# EAGLE design RomWriter (EAGLE 7.2.0)
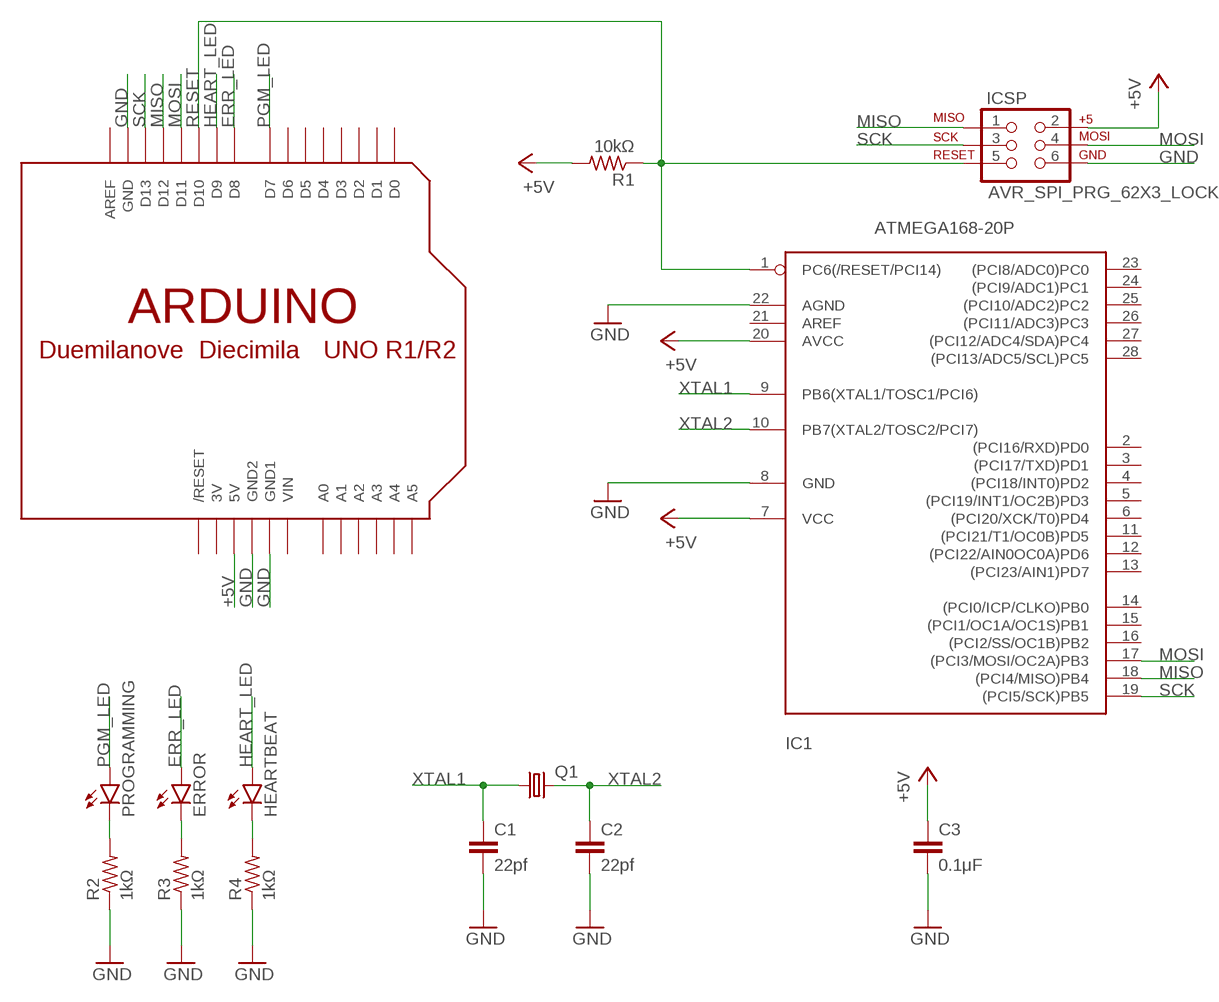
[diagram p0: schematic, sheet 1]

## Parts
C1  22pf  C2.5/2  [C2.5-2]
C2  22pf  C2.5/2  [C2.5-2]
C3  0.1μF  C2.5/2  [C2.5-2]
ERROR  LED3MM  [LED3MM]
HEARTBEAT  LED3MM  [LED3MM]
IC1  ATMEGA168-20P  [DIL28-3]
ICSP  AVR_SPI_PRG_62X3_LOCK  [2X3_LOCK]
PROGRAMMING  LED3MM  [LED3MM]
Q1  CRYSTALHC49S  [HC49/S]
R1  10kΩ  FLIPFLOP-RES  [0805-THM]
R2  1kΩ  FLIPFLOP-RES  [0805-THM]
R3  1kΩ  FLIPFLOP-RES  [0805-THM]
R4  1kΩ  FLIPFLOP-RES  [0805-THM]
U$1  ARDUINO_SHIELD_VER2  [ARDUINO_SHIELD]

## Nets
+5V: C3.1 IC1.7(VCC) IC1.20(AVCC) ICSP.2 R1.2 U$1.5V
ERR_LED: ERROR.A U$1.D8
GND: C1.2 C2.2 C3.2 IC1.8(GND) IC1.22(AGND) ICSP.6 R2.1 R3.1 R4.1 U$1.GND U$1.GND1 U$1.GND2
HEART_LED: HEARTBEAT.A U$1.D9
MISO: IC1.18((PCI4/MISO)PB4) ICSP.1 U$1.D12
MOSI: IC1.17((PCI3/MOSI/OC2A)PB3) ICSP.4 U$1.D11
N$6: PROGRAMMING.K(C) R2.2
N$7: ERROR.K(C) R3.2
N$8: HEARTBEAT.K(C) R4.2
PGM_LED: PROGRAMMING.A U$1.D7
RESET: IC1.1(PC6(/RESET/PCI14)) ICSP.5 R1.1 U$1.D10
SCK: IC1.19((PCI5/SCK)PB5) ICSP.3 U$1.D13
XTAL1: C1.1 IC1.9(PB6(XTAL1/TOSC1/PCI6)) Q1.1
XTAL2: C2.1 IC1.10(PB7(XTAL2/TOSC2/PCI7)) Q1.2
Unconnected: IC1.2((PCI16/RXD)PD0) IC1.3((PCI17/TXD)PD1) IC1.4((PCI18/INT0)PD2) IC1.5((PCI19/INT1/OC2B)PD3) IC1.6((PCI20/XCK/T0)PD4) IC1.11((PCI21/T1/OC0B)PD5) IC1.12((PCI22/AIN0OC0A)PD6) IC1.13((PCI23/AIN1)PD7) IC1.14((PCI0/ICP/CLKO)PB0) IC1.15((PCI1/OC1A/OC1S)PB1) IC1.16((PCI2/SS/OC1B)PB2) IC1.21(AREF) IC1.23((PCI8/ADC0)PC0) IC1.24((PCI9/ADC1)PC1) IC1.25((PCI10/ADC2)PC2) IC1.26((PCI11/ADC3)PC3) IC1.27((PCI12/ADC4/SDA)PC4) IC1.28((PCI13/ADC5/SCL)PC5) U$1.A0 U$1.A1 U$1.A2 U$1.A3 U$1.A4 U$1.A5 U$1.AREF U$1.D0 U$1.D1 U$1.D2 U$1.D3 U$1.D4 U$1.D5 U$1.D6 U$1.RESET(/RESET)

## Power pins joined to a net without a drawn wire
3V: U$1.3V
VIN: U$1.VIN

## Library data of the parts
C1-C3 = capacitor-wima:C: CAPACITOR naming: grid - package width
ERROR HEARTBEAT PROGRAMMING = SparkFun-LED:LED: LEDs Standard schematic elements and footprints for 5mm, 3mm, 1206, and 0603 sized LEDs. 5mm - Spark Fun Electronics SKU : COM-00529 (and others)
IC1 = mylib:ATMEGA168*P: MICROCONTROLLER 16 kBytes FLASH 1 kBytes SRAM 512 Bytes EEPROM USART 8-channel 10 bit ADC
ICSP = mylib:AVR_SPI_PRG_6: AVR ISP 6 Pin This is the reduced ISP connector for AVR programming. Common on Arduino. This footprint will take up less PCB space and can be used with a 10-pin to 6-pin adapter such as SKU: BOB-08508 **Special note about "TEST_POINT" package. The stop mask is on the top side, so if you want your programming test points to be on the bottom of your board, make sure to place this package on the bottom side of the board. This also ensure that the orientation to program from the bottom side will be correct.
Q1 = adafruit:CRYSTAL: CRYSTAL; OC_FARNELL: 1667008; OC_NEWARK: unknown
R1-R4 = adafruit:FLIPFLOP-RES: Flip Flop resistor An 0805 resistor inside a standard 1/4W 5% resistor. Makes for easy mods
U$1 = mylib:ARDUINO_SHIELD_VER2

## Board
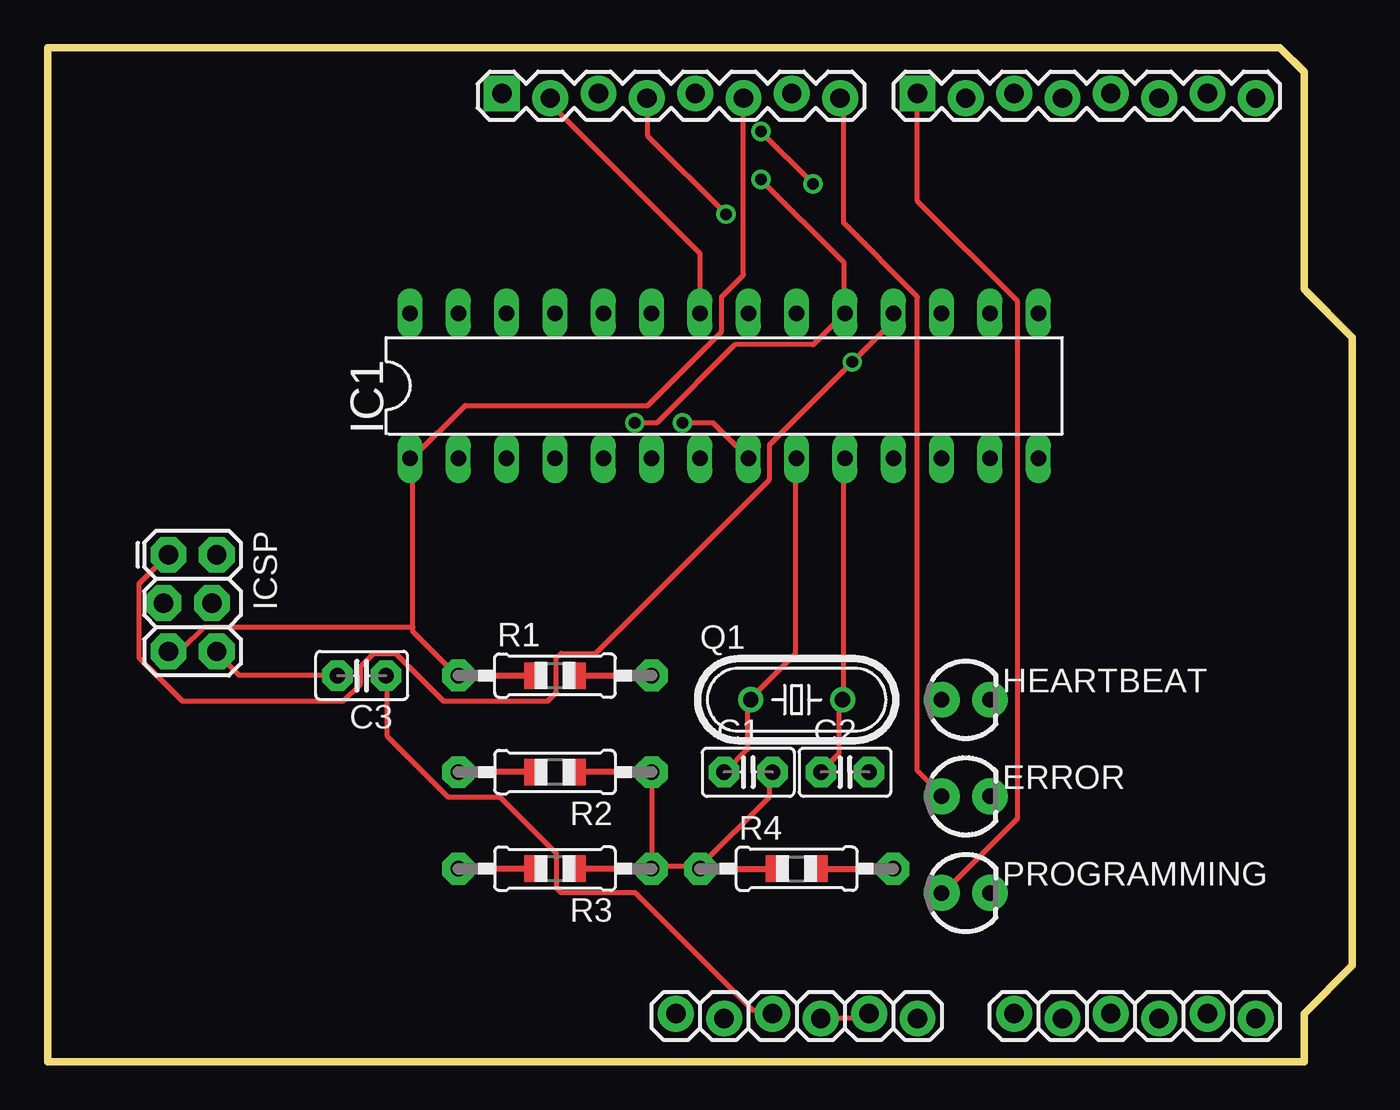
[diagram p1: board, top side]
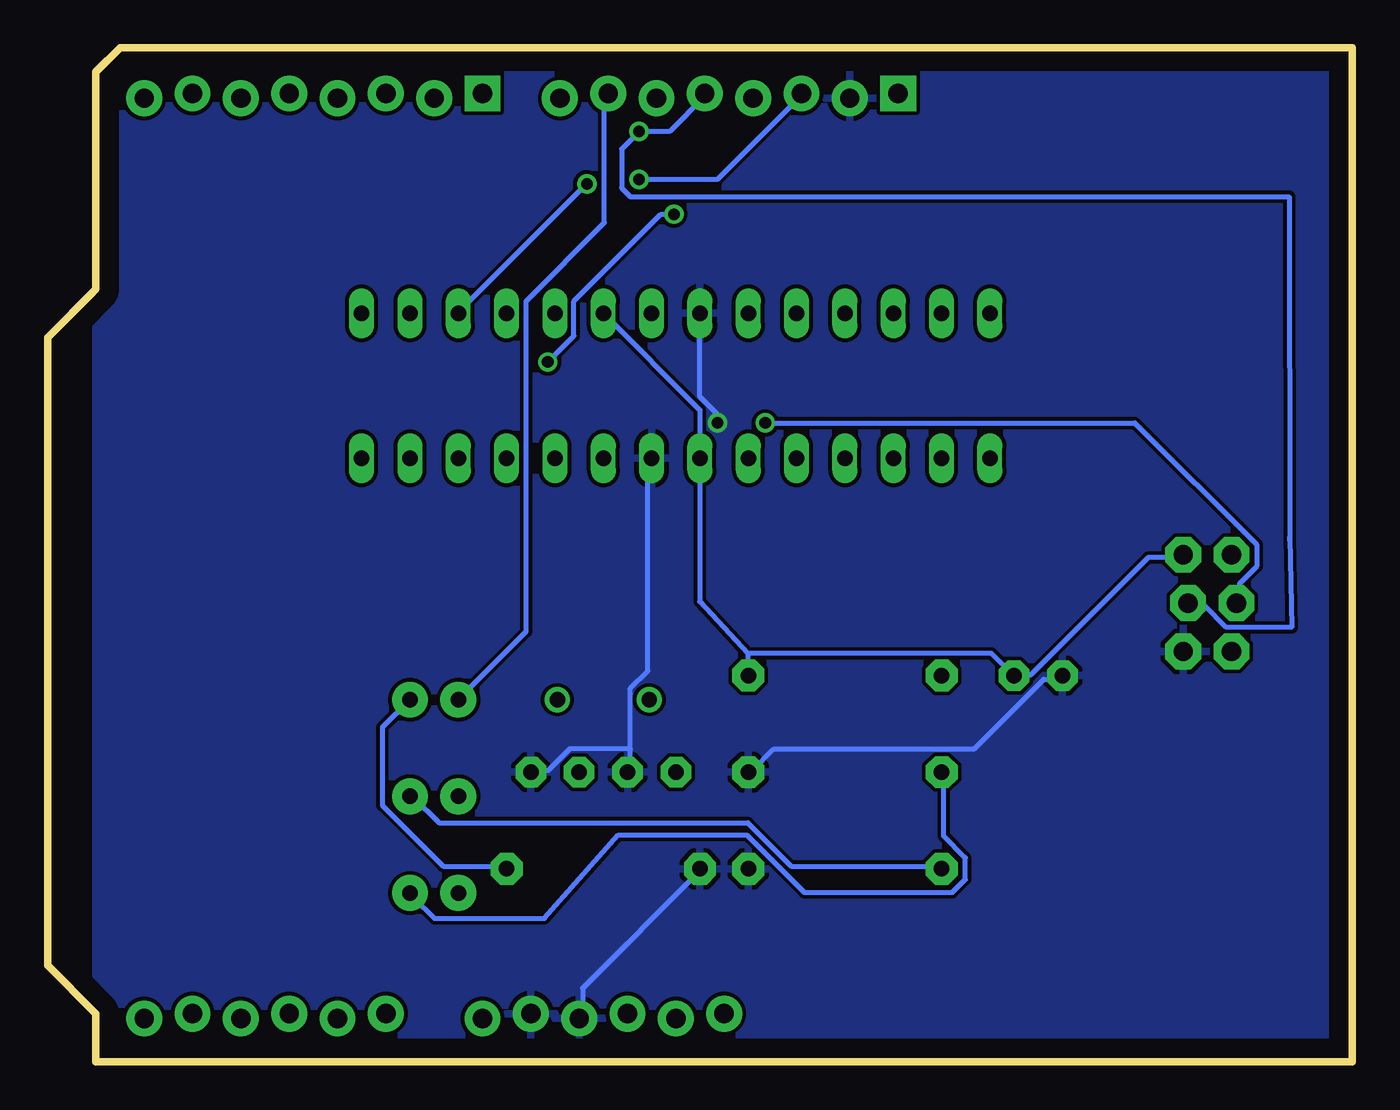
[diagram p2: board, bottom side, seen from below]

Size 68.58 x 53.34 mm. Coordinates in mm from the lower left corner, seen from the top.
Outline: 0,0 66.04,0 66.04,2.54 68.58,5.08 68.58,38.1 66.04,40.64 66.04,52.07 64.77,53.34 0,53.34 0,0
Copper layers (1*16): Top 0.035mm / dielectric 1.5mm / Bottom 0.035mm
Design rules "default": minimum track width 10mil, minimum drill 24mil, track to track 8mil, track to pad 8mil, pad to pad 8mil, via to via 8mil, smd to smd 8mil, copper to edge 40mil, drill to drill 8mil, minimum pad ring 10mil, minimum via ring 8mil, stop-mask expansion 4mil, vias tented up to drill 0mil, thermal gap 10mil

### Footprints (pad centres in the part's own frame; a part is rotated, then mirrored left to right if it is on the bottom)
C2.5-2 = drill 0.813 pad 1.6 octagon: 1 -1.27,0; 2 1.27,0
LED3MM = drill 0.813 pad 1.88: A -1.27,0; K 1.27,0
DIL28-3 = drill 0.813 long: 1 -16.51,-3.81; 2 -13.97,-3.81; 3 -11.43,-3.81; 4 -8.89,-3.81; 5 -6.35,-3.81; 6 -3.81,-3.81; 7 -1.27,-3.81; 8 1.27,-3.81; 9 3.81,-3.81; 10 6.35,-3.81; 11 8.89,-3.81; 12 11.43,-3.81; 13 13.97,-3.81; 14 16.51,-3.81; 15 16.51,3.81; 16 13.97,3.81; 17 11.43,3.81; 18 8.89,3.81; 19 6.35,3.81; 20 3.81,3.81; 21 1.27,3.81; 22 -1.27,3.81; 23 -3.81,3.81; 24 -6.35,3.81; 25 -8.89,3.81; 26 -11.43,3.81; 27 -13.97,3.81; 28 -16.51,3.81
2X3_LOCK = drill 1.016 pad 1.88 octagon: 1 0,0; 2 0,2.54; 3 2.54,-0.254; 4 2.54,2.286; 5 5.08,0; 6 5.08,2.54
HC49/S = drill 0.813: 1 -2.413,0; 2 2.413,0
0805-THM = drill 0.813 pad 1.676 octagon: 1 -5.08,0; 2 5.08,0
ARDUINO_SHIELD = drill 1.016 pad 1.88: 3V 35.56,2.286; 5V 38.1,2.54; A0 50.8,2.54; A1 53.34,2.286; A2 55.88,2.54; A3 58.42,2.286; A4 60.96,2.54; A5 63.5,2.286; D0 63.5,50.673; D1 60.96,50.927; D2 58.42,50.673; D3 55.88,50.927; D4 53.34,50.673; D5 50.8,50.927; D6 48.26,50.673; D8 41.656,50.673; D9 39.116,50.927; D10 36.576,50.673; D11 34.036,50.927; D12 31.496,50.673; D13 28.956,50.927; GND 26.416,50.673; GND1 43.18,2.54; GND2 40.64,2.286; RESET 33.02,2.54; VIN 45.72,2.286 | drill 1.016 pad 1.88 square: AREF 23.876,50.927; D7 45.72,50.927

### Placement (x,y rotation side)
C1  36.83,15.24 0 top
C2  41.91,15.24 0 top
C3  16.51,20.32 180 top
ERROR  48.26,13.97 0 top
HEARTBEAT  48.26,19.05 0 top
IC1  35.56,35.56 0 top
ICSP  6.35,26.67 270 top
PROGRAMMING  48.26,8.89 0 top
Q1  39.37,19.05 0 top
R1  26.67,20.32 0 top
R2  26.67,15.24 180 top
R3  26.67,10.16 180 top
R4  39.37,10.16 0 top
U$1  0,0 0 top

### Tracks (layer width: path | path; a pad name or v marks a point on that pad's centre or on a via)
+5V
  Top 0.254: U$1.5V 37.95,2.74 37.03,2.74 30.86,8.91 26.98,8.91 26.75,9.14 26.75,10.97 23.77,13.95 21.03,13.95 17.83,17.14 17.83,20.12 C3.1
  Bottom 0.254: IC1.20 34.29,34.29 IC1.7 34.29,31.55 34.31,24.21 31.77,21.49 | 31.77,21.49 31.77,20.34 R1.2 | ICSP.2 8.91,26.52 10.74,26.52 16.92,20.34 17.6,20.34 C3.1 17.83,20.34 18.97,21.49 31.77,21.49
ERR_LED
  Top 0.254: U$1.D8 41.83,50.52 41.83,44.12 45.72,40.23 45.72,15.32 46.86,14.17 ERROR.A
GND  (via drill 0.61)
  Top 0.254: IC1.22 34.29,42.52 26.29,50.52 U$1.GND | v33.38,33.6 34.98,33.6 IC1.8 | C3.2 15.09,20.34 10.06,20.34 8.91,21.49 ICSP.6 | U$1.GND2 42.75,2.29 42.98,2.52 U$1.GND1 | 34.29,10.29 31.77,10.29 | 31.77,10.29 31.77,15.09 R2.1 | 31.77,10.29 R3.1 | 34.29,10.29 37.95,13.95 37.95,15.09 C1.2 | 34.29,10.29 R4.1
  Bottom 0.254: 37.95,16.46 37.95,15.32 C1.2 | 37.95,16.46 37.95,19.66 37.03,20.57 37.03,31.55 IC1.8 | 37.95,16.46 41.15,16.46 42.29,15.32 42.98,15.32 C2.2 | IC1.22 34.29,34.98 33.38,34.06 v33.38,33.6 | U$1.GND2 40.46,2.29 40.46,3.89 34.29,10.06 R4.1 | C3.2 15.32,20.12 16.23,20.12 19.89,16.46 30.4,16.46 31.55,15.32 R2.1
  pour Bottom: 0,53.59 66.04,53.59 66.04,0 0,0
HEART_LED
  Bottom 0.254: U$1.D9 39.32,50.75 39.32,44.12 43.43,40.01 43.43,22.63 46.86,19.2 HEARTBEAT.A
MISO  (via drill 0.61)
  Top 0.254: IC1.18 44.35,39.32 44.35,38.86 v42.29,36.8 37.95,32.46 37.95,30.63 28.8,21.49 26.98,21.49 26.75,21.26 26.75,19.43 26.29,18.97 20.8,18.97 18.29,21.49 17.14,21.49 16.46,20.8 16.46,19.89 15.54,18.97 7.09,18.97 4.8,21.26 4.8,25.15 6.17,26.52 ICSP.1 | v35.66,44.58 31.55,48.69 31.55,50.52 U$1.D12
  Bottom 0.254: v35.66,44.58 36.35,44.58 40.92,40.01 40.92,38.18 v42.29,36.8
MOSI  (via drill 0.61)
  Top 0.254: v37.49,48.92 v40.23,46.18
  Bottom 0.254: v40.23,46.18 46.86,39.55 IC1.17 | U$1.D11 34.06,50.75 35.89,48.92 v37.49,48.92 38.41,48.01 38.41,45.95 37.95,45.49 3.33,45.49 3.3,27.43 3.3,27.58 3.2,22.86 6.63,22.86 7.77,24 8.46,24 ICSP.4
N$6
  Bottom 0.254: R2.2 21.49,15.09 21.49,11.89 20.34,10.74 20.34,9.6 21.03,8.91 28.8,8.91 31.83,11.94 38.58,11.94 42.47,7.54 48.23,7.54 49.38,8.69 PROGRAMMING.K
N$7
  Bottom 0.254: R3.2 21.72,10.29 29.49,10.29 31.77,12.57 48.01,12.57 49.38,13.95 ERROR.K
N$8
  Bottom 0.254: HEARTBEAT.K 50.98,17.6 50.98,13.49 47.78,10.29 44.58,10.29 R4.2
PGM_LED
  Top 0.254: U$1.D7 45.72,45.26 50.98,40.01 50.98,12.8 47.09,8.91 PROGRAMMING.A
RESET
  Top 0.254: 19.2,22.86 19.2,22.63 21.49,20.34 R1.1 | 19.2,22.86 19.2,31.55 IC1.1 19.2,31.77 21.95,34.52 31.55,34.52 35.43,38.41 35.43,40.23 36.58,41.38 U$1.D10 | 19.2,22.86 8.23,22.86 7.09,21.72 6.4,21.72 ICSP.5
SCK  (via drill 0.61)
  Top 0.254: v37.49,46.41 41.83,42.06 41.83,39.55 IC1.19 41.83,39.32 40.23,37.72 36.12,37.72 32,33.6 v30.86,33.6
  Bottom 0.254: v37.49,46.41 33.38,46.41 29.03,50.75 U$1.D13 | v30.86,33.6 11.43,33.6 5.03,27.2 5.03,26.06 5.94,25.15 5.94,24.23 ICSP.3
XTAL1
  Top 0.254: C1.1 35.66,15.32 36.8,16.46 36.8,18.97 Q1.1 37.03,19.2 39.32,21.49 39.32,31.55 IC1.9
XTAL2
  Top 0.254: C2.1 40.69,15.32 41.6,16.23 41.6,18.97 Q1.2 41.83,19.2 41.83,31.55 IC1.10